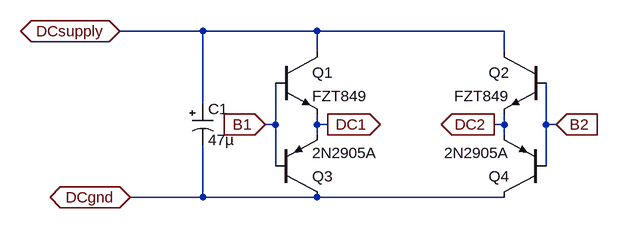
[diagram p0: schematic MotorDriver.asc]
MotorDriver.asc, the LTspice schematic file:
Version 4
SHEET 1 880 680
WIRE 112 96 -16 96
WIRE 288 96 112 96
WIRE 576 96 288 96
WIRE 288 128 288 96
WIRE 576 128 576 96
WIRE 112 208 112 96
WIRE 224 240 224 176
WIRE 224 240 208 240
WIRE 288 240 288 224
WIRE 304 240 288 240
WIRE 576 240 576 224
WIRE 576 240 560 240
WIRE 640 240 640 176
WIRE 656 240 640 240
WIRE 288 256 288 240
WIRE 576 256 576 240
WIRE 224 304 224 240
WIRE 640 304 640 240
WIRE 112 352 112 272
WIRE 112 352 0 352
WIRE 288 352 112 352
WIRE 576 352 288 352
FLAG -16 96 DCsupply
IOPIN -16 96 BiDir
FLAG 0 352 DCgnd
IOPIN 0 352 BiDir
FLAG 208 240 B1
IOPIN 208 240 In
FLAG 656 240 B2
IOPIN 656 240 In
FLAG 304 240 DC1
IOPIN 304 240 Out
FLAG 560 240 DC2
IOPIN 560 240 Out
SYMBOL npn 224 128 R0
SYMATTR InstName Q1
SYMATTR Value FZT849
SYMBOL npn 640 128 M0
SYMATTR InstName Q2
SYMATTR Value FZT849
SYMBOL polcap 96 208 R0
SYMATTR InstName C1
SYMATTR Value 47µ
SYMBOL pnp 224 352 M180
SYMATTR InstName Q3
SYMATTR Value 2N2905A
SYMBOL pnp 640 352 R180
SYMATTR InstName Q4
SYMATTR Value 2N2905A

The netlist it stands for:
* MotorDriver.asc
Q1 DCsupply B1 DC1 0 FZT849
Q2 DCsupply B2 DC2 0 FZT849
C1 DCsupply DCgnd 47µ
Q3 DCgnd B1 DC1 0 2N2905A
Q4 DCgnd B2 DC2 0 2N2905A
.model NPN NPN
.model PNP PNP
.lib standard.bjt
.backanno
.end